# EAGLE design tunable_filter (EAGLE 9.6.2)
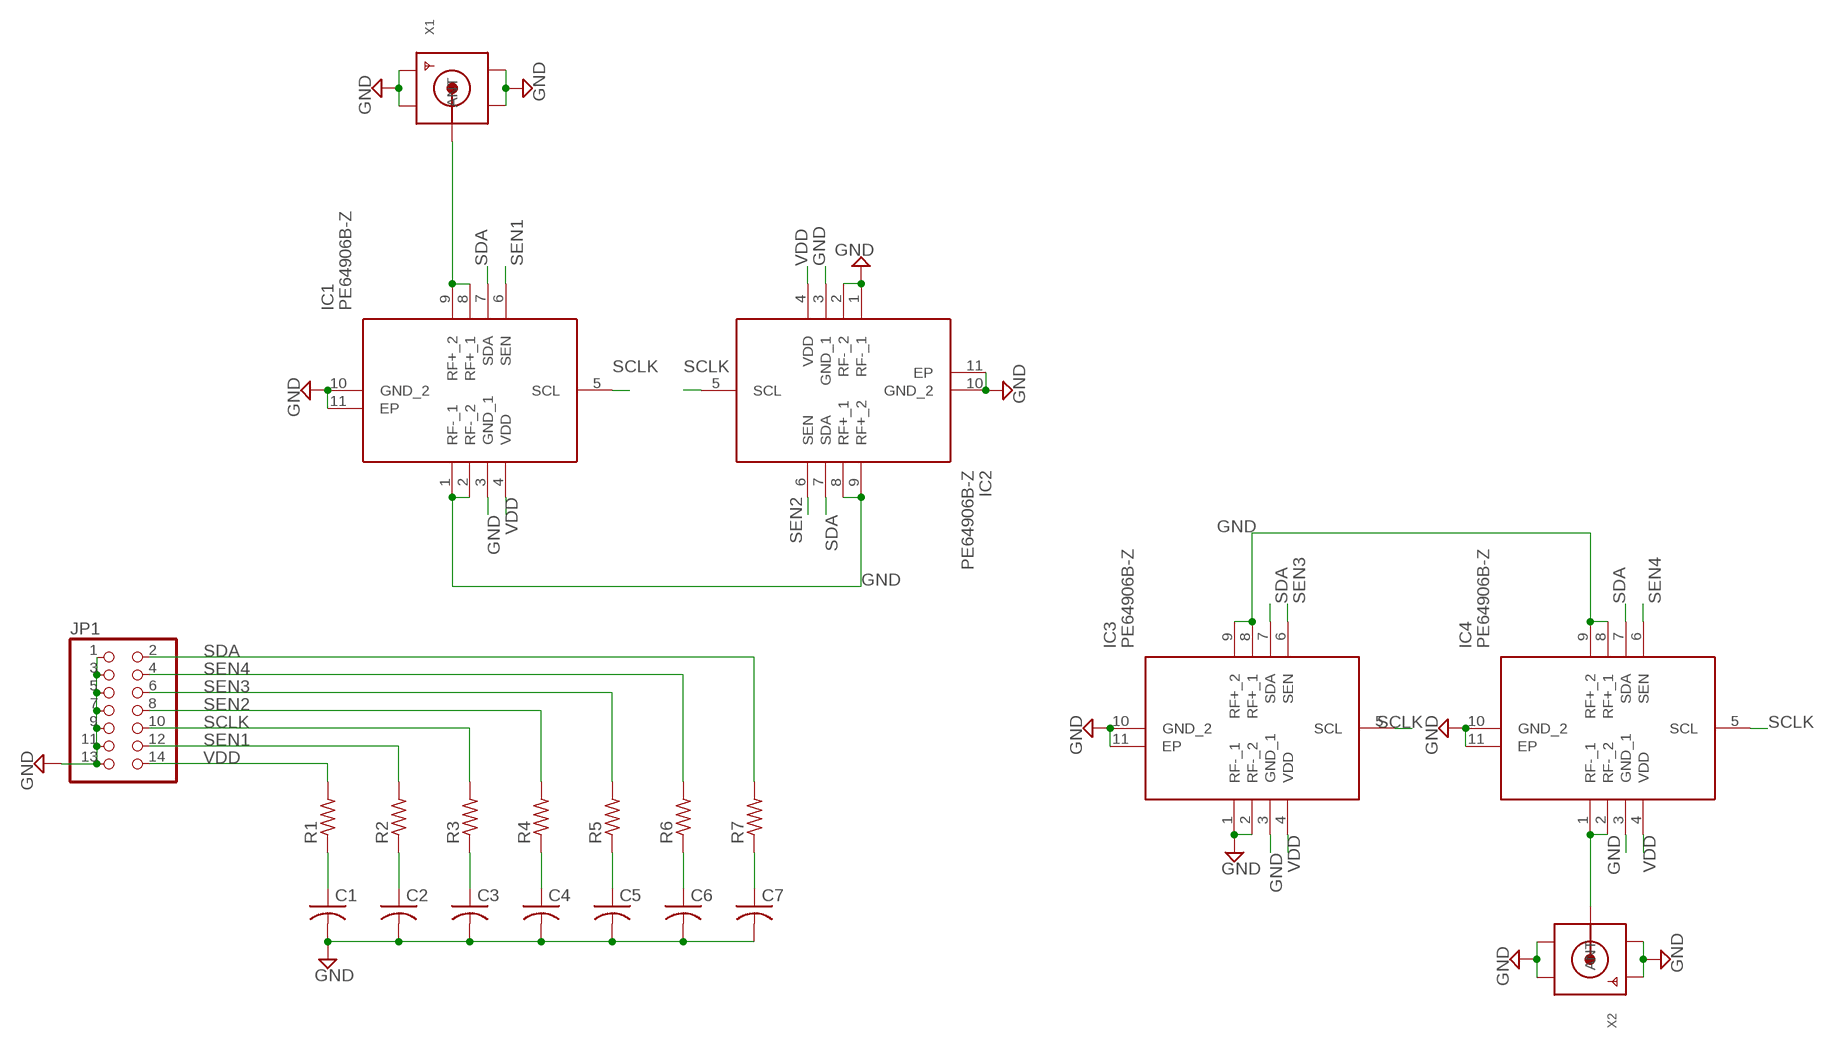
[diagram p0: schematic, sheet 1]

## Parts
C1  C-USC0402K  [C0402K]
C2  C-USC0402K  [C0402K]
C3  C-USC0402K  [C0402K]
C4  C-USC0402K  [C0402K]
C5  C-USC0402K  [C0402K]
C6  C-USC0402K  [C0402K]
C7  C-USC0402K  [C0402K]
IC1  PE64906B-Z  [QFN50P200X200X60-11N]
IC2  PE64906B-Z  [QFN50P200X200X60-11N]
IC3  PE64906B-Z  [QFN50P200X200X60-11N]
IC4  PE64906B-Z  [QFN50P200X200X60-11N]
JP1  PINHD-2X7  [2X07]
R1  R-US_R0402  [R0402]
R2  R-US_R0402  [R0402]
R3  R-US_R0402  [R0402]
R4  R-US_R0402  [R0402]
R5  R-US_R0402  [R0402]
R6  R-US_R0402  [R0402]
R7  R-US_R0402  [R0402]
X1  SMACONNECTOR_EDGE  [SMA_EDGELAUNCH]
X2  SMACONNECTOR_EDGE  [SMA_EDGELAUNCH]

## Nets
GND: C1.2 C2.2 C3.2 C4.2 C5.2 C6.2 C7.2 IC1.1(RF-_1) IC1.2(RF-_2) IC1.3(GND_1) IC1.10(GND_2) IC1.11(EP) IC2.1(RF-_1) IC2.2(RF-_2) IC2.3(GND_1) IC2.8(RF+_1) IC2.9(RF+_2) IC2.10(GND_2) IC2.11(EP) IC3.1(RF-_1) IC3.2(RF-_2) IC3.3(GND_1) IC3.8(RF+_1) IC3.9(RF+_2) IC3.10(GND_2) IC3.11(EP) IC4.3(GND_1) IC4.8(RF+_1) IC4.9(RF+_2) IC4.10(GND_2) IC4.11(EP) JP1.1 JP1.3 JP1.5 JP1.7 JP1.9 JP1.11 JP1.13 X1.GND@1(GND4) X1.GND@2(GND3) X1.GND@3(GND2) X1.GND@4(GND1) X2.GND@1(GND4) X2.GND@2(GND3) X2.GND@3(GND2) X2.GND@4(GND1)
N$1: IC1.8(RF+_1) IC1.9(RF+_2) X1.P(ANT)
N$3: C1.1 R1.1
N$4: C2.1 R2.1
N$5: C3.1 R3.1
N$7: IC4.1(RF-_1) IC4.2(RF-_2) X2.P(ANT)
N$8: C4.1 R4.1
N$9: C5.1 R5.1
N$10: C6.1 R6.1
N$11: C7.1 R7.1
SCLK: IC1.5(SCL) IC2.5(SCL) IC3.5(SCL) IC4.5(SCL) JP1.10 R3.2
SDA: IC1.7(SDA) IC2.7(SDA) IC3.7(SDA) IC4.7(SDA) JP1.2 R7.2
SEN1: IC1.6(SEN) JP1.12 R2.2
SEN2: IC2.6(SEN) JP1.8 R4.2
SEN3: IC3.6(SEN) JP1.6 R5.2
SEN4: IC4.6(SEN) JP1.4 R6.2
VDD: IC1.4(VDD) IC2.4(VDD) IC3.4(VDD) IC4.4(VDD) JP1.14 R1.2

## Library data of the parts
C1-C7 = rcl:C-US: CAPACITOR, American symbol; SPICEPREFIX: C
IC1-IC4 = PE64906B-Z:PE64906B-Z: IC RF DTC 100-3000MHZ 10QFN Source: Datasheet <http://www.psemi.com/pdf/datasheets/pe64906ds.pdf>; DESCRIPTION: IC RF DTC 100-3000MHZ 10QFN; HEIGHT: 0.6mm; MANUFACTURER_NAME: pSemi; MANUFACTURER_PART_NUMBER: PE64906B-Z; MOUSER_PART_NUMBER: 81-PE64906B-Z; MOUSER_PRICE-STOCK: https://www.mouser.co.uk/ProductDetail/pSemi/PE64906B-Z?qs=l7cgNqFNU1iSxoklLRhTNg%3D%3D
JP1 = pinhead:PINHD-2X7: PIN HEADER
R1-R7 = rcl:R-US_: RESISTOR, American symbol; SPICEPREFIX: R
X1 X2 = adafruit:SMACONNECTOR: SMA Connector 90° DIP SMA Connector, 50 Ohm (4UConnector: 07259)

## Board
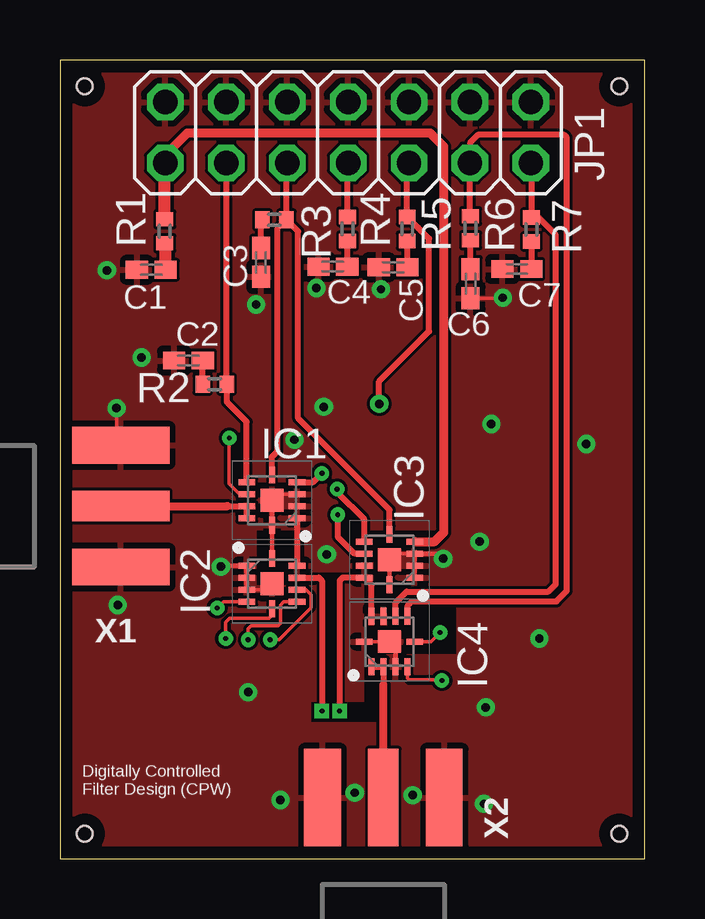
[diagram p1: board, top side]
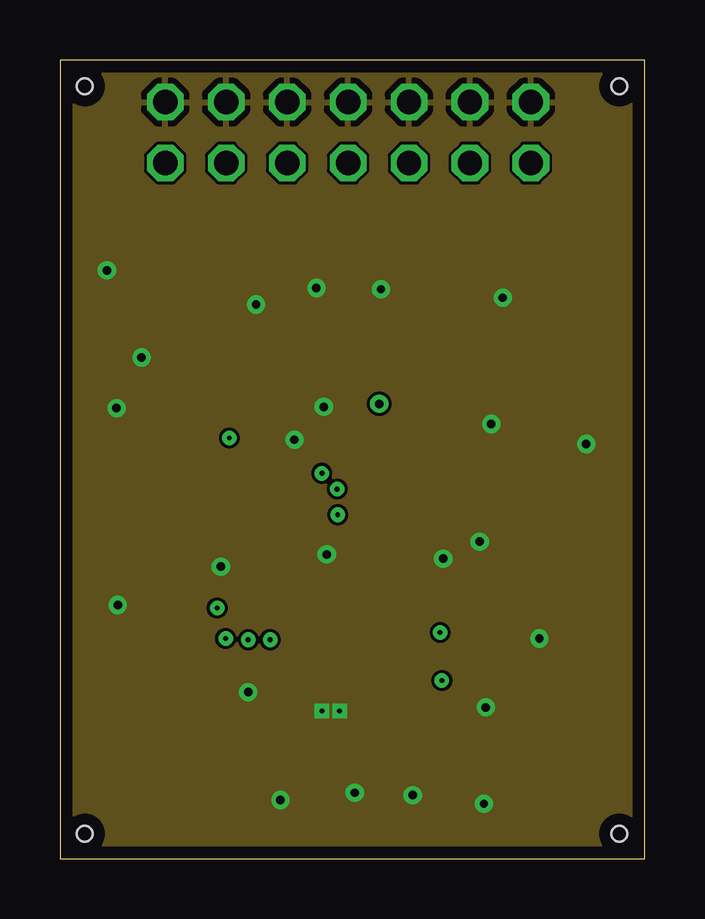
[diagram p2: board, inner layer Route2]
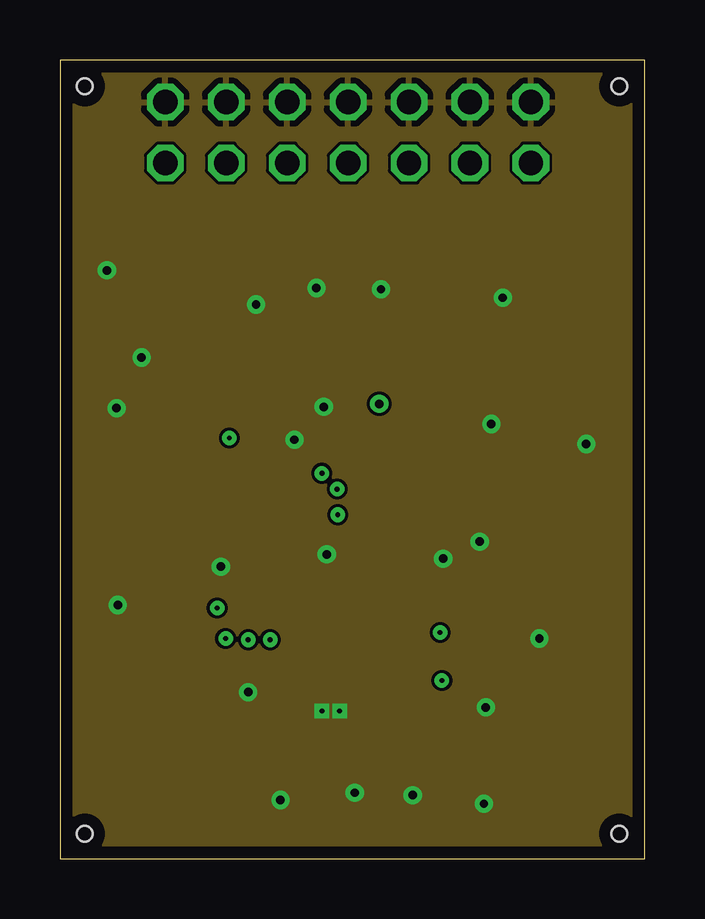
[diagram p3: board, inner layer Route15]
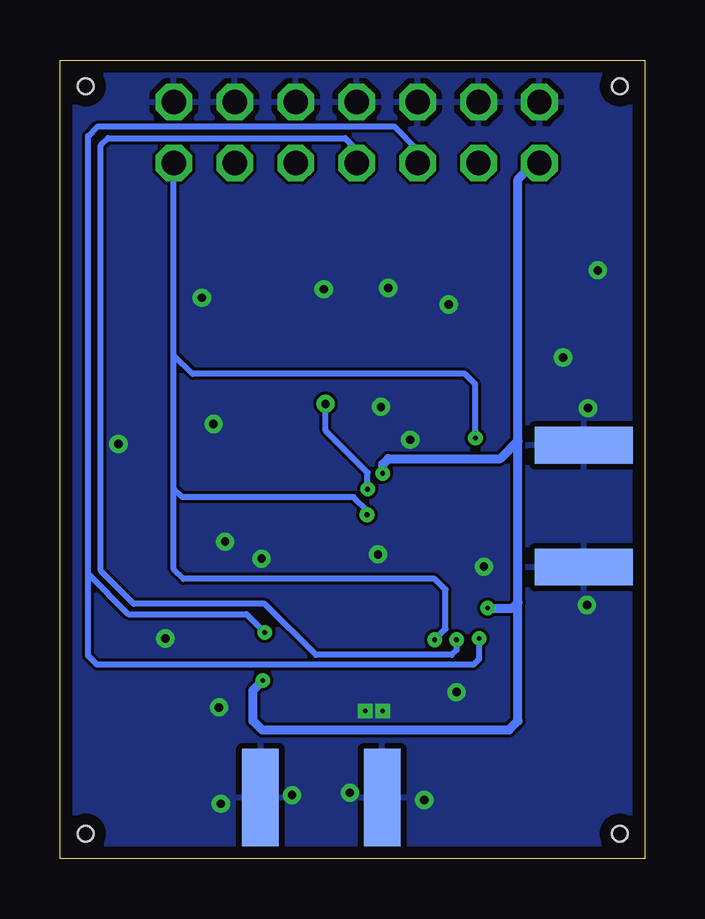
[diagram p4: board, bottom side, seen from below]

Size 24.38 x 33.27 mm. Coordinates in mm from the lower left corner, seen from the top.
Outline: 0,0 24.38,0 24.38,33.27 0,33.27 0,0
Copper layers (1+2*15+16): Top 0.035mm / dielectric 0.2mm / Route2 0.0175mm / dielectric 1.065mm / Route15 0.0175mm / dielectric 0.2mm / Bottom 0.035mm
Design rules "default *": minimum track width 6mil, minimum drill 0.2mm, track to track 5mil, track to pad 5mil, pad to pad 5mil, via to via 5mil, smd to smd 5mil, copper to edge 20mil, drill to drill 0.5mm, minimum pad ring 10mil, minimum via ring 8mil, stop-mask expansion 4mil, vias tented up to drill 0mil, thermal gap 10mil
Holes 0.65 mm at 1.04,32.18 23.32,32.18 23.32,1.04 1.04,1.04

### Footprints (pad centres in the part's own frame; a part is rotated, then mirrored left to right if it is on the bottom)
C0402K = smd 0.925 x 0.74: 1 -0.6,0; 2 0.6,0
QFN50P200X200X60-11N = smd 0.7 x 0.25: 1 -1.05,0.75; 2 -1.05,0.25; 3 -1.05,-0.25; 4 -1.05,-0.75; 6 1.05,-0.75; 7 1.05,-0.25; 8 1.05,0.25; 9 1.05,0.75 | smd 0.25 x 0.7: 5 0,-1.05; 10 0,1.05 | smd 0.95 x 0.95: 11 0,0
2X07 = drill 1.016 octagon: 1 -7.62,-1.27; 2 -7.62,1.27; 3 -5.08,-1.27; 4 -5.08,1.27; 5 -2.54,-1.27; 6 -2.54,1.27; 7 0,-1.27; 8 0,1.27; 9 2.54,-1.27; 10 2.54,1.27; 11 5.08,-1.27; 12 5.08,1.27; 13 7.62,-1.27; 14 7.62,1.27
R0402 = smd 0.6 x 0.7: 1 -0.5,0; 2 0.5,0
SMA_EDGELAUNCH = smd 4.064 x 1.524: GND@1 2.032,-2.54; GND@2 2.032,2.54 | smd 4.064 x 1.524 bottom: GND@3 2.032,2.54; GND@4 2.032,-2.54 | smd 4.064 x 1.27: P 2.032,0

### Placement (x,y rotation side)
C1  3.81,24.54 180 top
C2  5.36,20.75 180 top
C3  8.38,24.84 270 top
C4  11.38,24.66 180 top
C5  13.89,24.64 180 top
C6  17.12,23.95 270 top
C7  19.05,24.56 180 top
IC1  8.84,14.94 180 top
IC2  8.84,11.46 0 top
IC3  13.74,12.46 180 top
IC4  13.74,9.04 90 top
JP1  12.01,30.25 180 top
R1  4.37,26.14 90 top
R2  6.45,19.76 0 top
R3  8.94,26.62 0 top
R4  11.99,26.24 90 top
R5  14.48,26.24 90 top
R6  17.12,26.26 90 top
R7  19.66,26.21 90 top
X1  0.51,14.68 0 top
X2  13.49,0.51 90 top

### Tracks (layer width: path | path; a pad name or v marks a point on that pad's centre or on a via)
GND  (via drill 0.2 pad 0.55, 0.35)
  Top 0.152: IC2.3 8.59,11.2 IC2.11 | IC1.3 9.09,15.18 IC1.11 | IC3.3 13.99,12.7 IC3.11 | IC4.10 IC4.11 | v18.47,23.37 18.45,23.38 18.42,23.35 C6.2 | X1.GND@2 2.36,17.4 v2.36,18.77
  Top 0.178: v6.71,12.17 6.74,12.2 IC2.1 IC2.2 IC2.3 | IC4.3 13.99,8.79 IC4.11 | v15.98,12.5 15.77,12.7 IC3.3 IC3.2 IC3.1 | IC3.10 IC3.11 | IC2.10 IC1.10 IC1.11
  Top 0.254: IC2.8 10.8,11.7 10.92,11.58 v10.92,6.15 | IC1.1 IC2.9 | v11.66,6.15 11.66,11.58 11.78,11.7 IC3.9 12.99,11.41 IC4.9
  other vias: 17.98,18.11 11,18.82 17.5,13.21 19.99,9.17 21.95,17.27 17.75,6.3 1.96,24.51 3.4,20.88 8.18,23.09 10.69,23.77 13.39,23.72 2.41,10.57 9.19,2.44 17.68,2.29 7.85,6.93 11.13,12.67 9.78,17.45 12.29,2.74 14.71,2.64
  pour Bottom: -0.96,-1.3 25.02,-1.3 25.5,-0.81 25.5,34.53 -1.02,34.29
  pour Route2: -1.02,34.24 -1.02,-1.45 25.45,-1.52 25.68,34.52 25.69,34.52
  pour Route15: -1.07,33.86 -1.17,-0.89 25.38,-0.89 25.53,34.01
  pour Top (rank 5): 9.55,14.81 10.24,14.81 10.24,14.07 9.55,14.07
  pour Top (rank 5): 9.55,12.34 9.55,11.58 10.24,11.58 10.24,12.34
  pour Top (rank 3): 12.85,10.46 12.85,9.73 13.64,9.73 13.64,10.46
  pour Top (rank 3): 12.34,12.34 13.06,12.34 13.06,11.79 13.06,11.58 12.34,11.58
  pour Top: -0.25,33.53 -0.25,13.79 -0.2,13.74 24.94,13.74 24.94,33.53
  pour Top: 0.36,14.4 8.1,14.4 8.13,14.38 8.13,-0.18 8.15,-0.2 0.36,-0.2 0.33,-0.18 0.33,14.35 0.3,14.38
  pour Top: 16.59,14.1 16.59,-0.43 24.77,-0.38 24.77,14.02
  pour Top: 6.27,11.38 10.67,11.4 10.67,6.53 5.97,6.53 5.97,11.43 6.22,11.43
  pour Top: 11.91,11.46 12.65,11.46 12.65,6.53 11.91,6.53
  pour Top: 10.39,11.93 10.39,12.42 10.21,12.6 10.21,13.74 10.24,13.77 11.38,13.77 11.38,13.26 12.17,12.47 12.17,11.93
  pour Top: 7.62,7.37 7.62,5.61 10.46,5.61 10.46,7.37
  pour Top: 12.07,8.48 12.07,3.84 12.04,3.81 17.58,3.81 17.6,3.84 17.6,8.48
  pour Top: 12.73,0.76 11.91,0.76 11.89,0.79 11.89,3.84 12.75,3.84
  pour Top: 8.08,5.69 17.35,5.69 22.61,0.43 8.02,0.43
  pour Top: 14.02,14.25 14.02,8.48 17.09,8.48 17.12,8.51 17.12,14.33 14.07,14.33 14.02,14.27
N$1
  Top 0.254: 6.99,14.68 IC1.8 arc90 IC1.8 IC1.9
  Top 0.343: X1.P 6.99,14.68
  pour Top (rank 4): 7.44,14.05 8.15,14.05 8.15,14.81 7.44,14.81 7.42,14.78 7.42,14.07
N$3
  Top 0.508: C1.1 4.41,25.6 R1.1
N$4
  Top 0.254: R2.1 C2.1
N$5
  Top 0.254: C3.1 8.38,26.56 R3.1
N$7
  Top 0.254: IC4.2 13.49,7.24 | IC4.2 arc-90 IC4.2 | IC4.1 IC4.2 | IC4.2
  Top 0.343: X2.P 13.49,7.24
  pour Top (rank 2): 12.88,8.33 13.61,8.33 13.61,7.65 12.88,7.65
N$8
  Top 0.254: C4.1 11.98,25.73 R4.1
N$9
  Top 0.254: C5.1 14.49,25.72 R5.1
N$10
  Top 0.254: C6.1 17.11,25.75 R6.1
N$11
  Top 0.254: R7.1 C7.1
SCLK  (via drill 0.2 pad 0.55)
  Top 0.152: IC2.5 8.84,10.14 8.71,10.01 7.07,10.01 6.91,9.85 v6.91,9.17 | v15.85,9.42 15.47,9.04 IC4.5
  Top 0.254: R3.2 9.44,28.95 JP1.10 | IC1.5 8.84,16.74 9.06,16.96 9.06,26.24 R3.2 | IC3.5 13.74,14.53 9.93,18.34 9.93,26.13 R3.2
  Bottom 0.254: v6.91,9.17 6.91,8.31 7.14,8.08 22.84,8.08 23.22,8.46 23.22,11.86 | 23.22,11.86 23.22,30.1 22.81,30.51 10.44,30.51 9.47,29.54 JP1.10 | v15.85,9.42 16.61,10.18 21.54,10.18 23.22,11.86
SDA  (via drill 0.2 pad 0.55)
  Top 0.152: IC2.7 10.26,11.2 10.47,11 10.47,10.44 9.14,9.12 v8.76,9.12 | IC1.7 7.5,15.18 7.06,15.62 v7.06,17.53
  Top 0.254: JP1.2 19.66,28.96 R7.2 19.95,26.71 20.68,25.98 20.68,11.43 20.37,11.12 14.45,11.12 13.99,10.66 IC4.7 | IC3.7 12.29,12.7 11.58,13.41 v11.58,14.33
  Bottom 0.254: v11.58,14.33 11.58,14.5 12.14,15.06 19.28,15.06 19.63,15.42 | 19.63,15.42 19.63,20.98 | 19.63,20.98 JP1.2 | v7.06,17.53 7.06,19.76 7.49,20.19 18.85,20.19 19.63,20.98 | v8.76,9.12 8.31,9.58 8.31,11.2 8.76,11.66 19.23,11.66 19.63,12.07 19.63,15.42
SEN1
  Top 0.254: IC1.6 7.79,18.2 6.95,19.03 R2.2 6.95,28.96 JP1.12
SEN2  (via drill 0.2 pad 0.55)
  Top 0.152: IC2.6 9.88,10.69 9.32,10.69 9.19,10.56 9.19,9.81 9.09,9.7 7.98,9.7 7.85,9.58 v7.85,9.12
  Top 0.254: R4.2 11.99,28.96 JP1.8
  Bottom 0.254: v7.85,9.12 7.85,8.69 8.05,8.48 13.72,8.48 15.85,10.62 21.31,10.62 22.68,11.99 22.68,29.72 22.38,30.02 12.5,30.02 12.01,29.54 JP1.8
SEN3  (via drill 0.2 pad 0.55, 0.35)
  Top 0.254: IC3.6 12.69,14.13 11.56,15.27 v11.56,15.39 | JP1.6 14.48,28.91 R5.2 14.92,26.29 14.93,26.29 15.39,25.83 15.39,21.97 13.31,19.89 v13.31,18.95
  Bottom 0.254: v11.56,15.39 11.56,16.08 13.31,17.83 v13.31,18.95
SEN4
  Top 0.254: R6.2 17.09,26.79 JP1.4 17.09,29.82 17.42,30.15 21.03,30.15 21.13,30.05 21.13,11.15 20.7,10.72 14.68,10.72 14.49,10.53 IC4.6
VDD  (via drill 0.2 pad 0.55)
  Top 0.152: IC2.4 6.82,10.7 v6.55,10.44 | IC4.4 14.49,7.5 14.55,7.44 15.9,7.44 v15.93,7.42
  Top 0.254: IC1.4 10.55,15.69 v10.92,16.05
  Top 0.381: IC3.4 15.62,13.2 16,13.59 16,29.67 15.44,30.23 5.31,30.23 4.37,29.29
  Top 0.508: R1.2 4.37,28.96 | 4.37,28.96 JP1.14 | 4.37,29.29 4.37,28.96
  Bottom 0.381: v10.92,16.05 10.92,16.43 10.69,16.66 6.02,16.66 5.28,17.4 | 5.28,17.4 5.28,28.3 4.6,28.98 JP1.14 | v6.55,10.44 5.51,10.44 5.28,10.67 | 5.28,10.67 5.28,17.4 | 5.28,10.67 5.28,5.74 5.66,5.36 15.95,5.36 16.33,5.74 16.33,7.01 v15.93,7.42

### Text on the board
tPlace: Digitally Controlled / Filter Design (CPW)